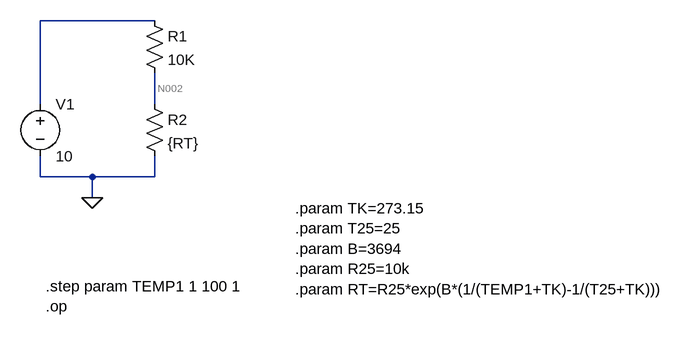
[diagram p0: schematic test_ntc.asc]
test_ntc.asc, the LTspice schematic file:
Version 4
SHEET 1 1372 680
WIRE 512 -208 336 -208
WIRE 336 -80 336 -208
WIRE 512 -80 512 -128
WIRE 336 32 336 0
WIRE 416 32 336 32
WIRE 512 32 512 0
WIRE 512 32 416 32
WIRE 416 64 416 32
FLAG 416 64 0
SYMBOL voltage 336 -96 R0
WINDOW 123 0 0 Left 0
WINDOW 39 0 0 Left 0
SYMATTR InstName V1
SYMATTR Value 10
SYMBOL res 496 -224 R0
SYMATTR InstName R1
SYMATTR Value 10K
SYMBOL res 496 -96 R0
SYMATTR InstName R2
SYMATTR Value {RT}
TEXT 344 200 Left 2 !.step param TEMP1 1 100 1\n.op
TEXT 728 80 Left 2 !.param TK=273.15\n.param T25=25\n.param B=3694\n.param R25=10k\n.param RT=R25*exp(B*(1/(TEMP1+TK)-1/(T25+TK)))

The netlist it stands for:
* test_ntc.asc
V1 N001 0 10
R1 N001 N002 10K
R2 N002 0 {RT}
.step param TEMP1 1 100 1
.op
.param TK=273.15
.param T25=25
.param B=3694
.param R25=10k
.param RT=R25*exp(B*(1/(TEMP1+TK)-1/(T25+TK)))
.backanno
.end

* Results of the author's LTspice run, read from the files saved beside the schematic
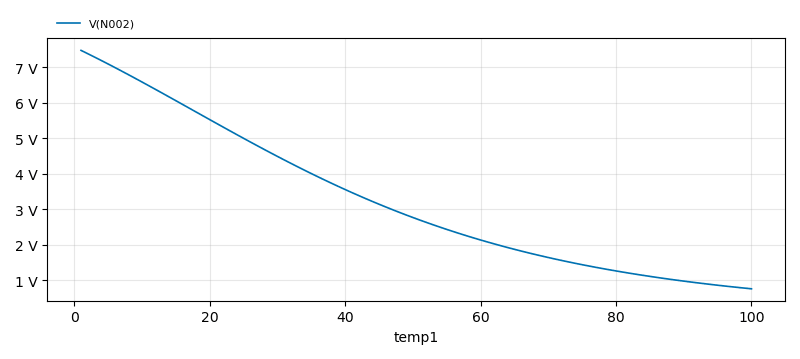
[diagram p1: Operating Point of test_ntc.asc, plotted from the saved traces]
* Operating Point, 1 run:
*   V(N002): 7.474 V at temp1=1 , 765.5 mV at temp1=100 , min 765.5 mV, max 7.474 V